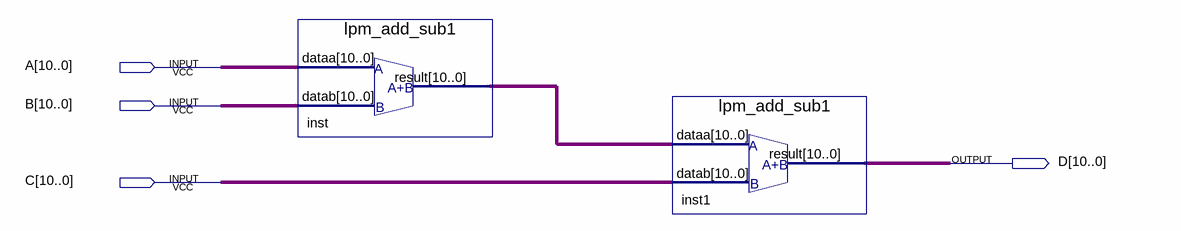
[diagram p0: schematic sheet]
// Quartus schematic ADD15_5.bdf as structural Verilog: 2 symbols, 4 pins
module ADD15_5 (
  input  [10:0] A,
  input  [10:0] B,
  input  [10:0] C,
  output [10:0] D
);

  wire [10:0] inst_result;

  lpm_add_sub1 inst (.dataa(A), .datab(B), .result(inst_result));
  lpm_add_sub1 inst1 (.dataa(inst_result), .datab(C), .result(D));
endmodule
